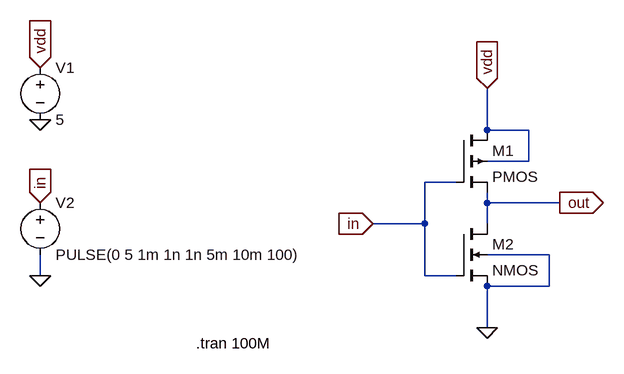
[diagram p0: schematic Design and Simulation of CMOS Inverter (1).asc]
Design and Simulation of CMOS Inverter (1).asc, the LTspice schematic file:
Version 4.1
SHEET 1 880 680
WIRE 176 64 176 0
WIRE 240 64 176 64
WIRE 240 112 240 64
WIRE 240 112 176 112
WIRE 128 144 80 144
WIRE 176 176 176 160
WIRE 288 176 176 176
WIRE 80 208 80 144
WIRE 80 208 0 208
WIRE 176 208 176 176
WIRE 272 256 176 256
WIRE -512 288 -512 256
WIRE 80 288 80 208
WIRE 128 288 80 288
WIRE 272 304 272 256
WIRE 272 304 176 304
WIRE 176 368 176 304
FLAG 176 368 0
FLAG 0 208 in
IOPIN 0 208 In
FLAG 288 176 out
IOPIN 288 176 Out
FLAG 176 0 vdd
IOPIN 176 0 In
FLAG -512 288 0
FLAG -512 176 in
IOPIN -512 176 In
FLAG -512 48 0
FLAG -512 -32 vdd
IOPIN -512 -32 In
SYMBOL pmos4 128 64 R0
SYMATTR InstName M1
SYMBOL nmos4 128 208 R0
SYMATTR InstName M2
SYMBOL voltage -512 160 R0
WINDOW 123 0 0 Left 0
WINDOW 39 0 0 Left 0
SYMATTR InstName V2
SYMATTR Value PULSE(0 5 1m 1n 1n 5m 10m 100)
SYMBOL voltage -512 -48 R0
WINDOW 123 0 0 Left 0
WINDOW 39 0 0 Left 0
SYMATTR InstName V1
SYMATTR Value 5
TEXT -272 392 Left 2 !.tran 100M

The netlist it stands for:
* Design and Simulation of CMOS Inverter (1).asc
M1 vdd in out vdd PMOS
M2 out in 0 0 NMOS
V2 in 0 PULSE(0 5 1m 1n 1n 5m 10m 100)
V1 vdd 0 5
.model NMOS NMOS
.model PMOS PMOS
.lib standard.mos
.tran 100M
.backanno
.end